# Altium schematic sheet Interface.SchDoc
size A; SheetNumber: 2
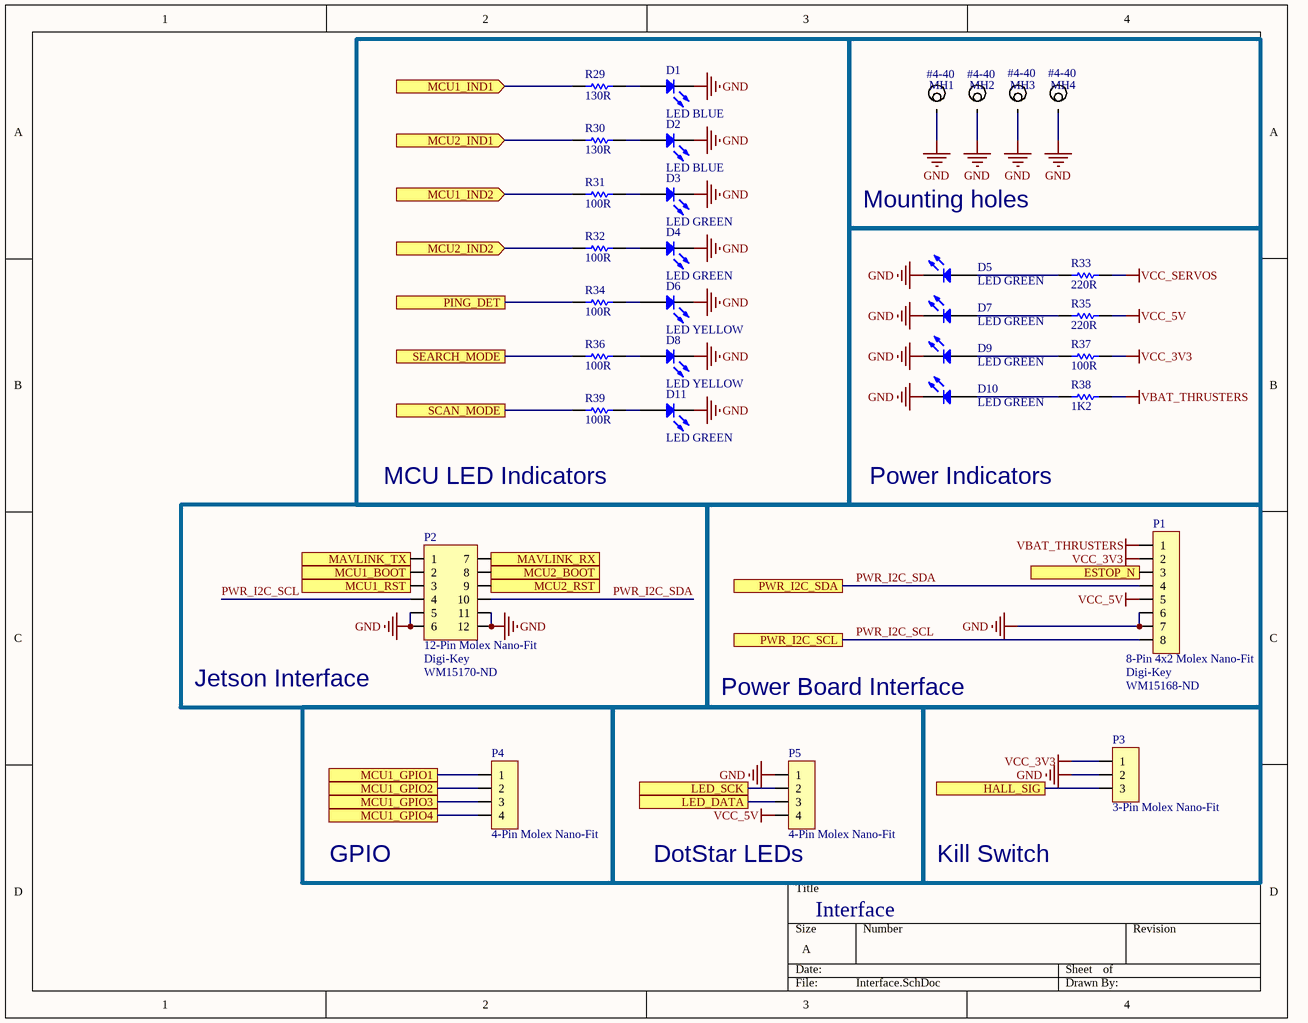
[diagram p0: Interface.SchDoc]

## Parts
D1  LED BLUE  [LED_0805]
D2  LED BLUE  [LED_0805]
D3  LED GREEN  [LED_0805]
D4  LED GREEN  [LED_0805]
D5  LED GREEN  [LED_0805]
D6  LED YELLOW  [LED_0805]
D7  LED GREEN  [LED_0805]
D8  LED YELLOW  [LED_0805]
D9  LED GREEN  [LED_0805]
D10  LED GREEN  [LED_0805]
D11  LED GREEN  [LED_0805]
MH1  #4-40  [Mounting Hole #4-40]
MH2  #4-40  [Mounting Hole #4-40]
MH3  #4-40  [Mounting Hole #4-40]
MH4  #4-40  [Mounting Hole #4-40]
P1  8-Pin 4x2 Molex Nano-Fit  Supplier 1: Digi-Key  Supplier Part Number 1: WM15168-ND  [MOLEX NANO-FIT 2x4]
P2  12-Pin Molex Nano-Fit  Supplier 1: Digi-Key  Supplier Part Number 1: WM15170-ND  [MOLEX NANO-FIT 2X6 - Right Angle]
P3  3-Pin Molex Nano-Fit  [MOLEX NANO-FIT 1X3]
P4  4-Pin Molex Nano-Fit  [MOLEX NANO-FIT 1X4]
P5  4-Pin Molex Nano-Fit  [MOLEX NANO-FIT 1X4]
R29  130R  [RESC0603(1608)_N]
R30  130R  [RESC0603(1608)_N]
R31  100R  [RESC0603(1608)_N]
R32  100R  [RESC0603(1608)_N]
R33  220R  [RESC0603(1608)_N]
R34  100R  [RESC0603(1608)_N]
R35  220R  [RESC0603(1608)_N]
R36  100R  [RESC0603(1608)_N]
R37  100R  [RESC0603(1608)_N]
R38  1K2  [RESC0603(1608)_N]
R39  100R  [RESC0603(1608)_N]

## Blocks framed on the sheet
MCU LED Indicators: D1-D4 D6 D8 D11 R29-R32 R34 R36 R39
Mounting holes: MH1-MH4
Power Indicators: D5 D7 D9 D10 R33 R35 R37 R38
GPIO: P4
Kill Switch: P3

## Ports
ESTOP_N, HALL_SIG, LED_DATA, LED_SCK, MAVLINK_RX, MAVLINK_TX, MCU1_BOOT (in), MCU1_GPIO1, MCU1_GPIO2, MCU1_GPIO3, MCU1_GPIO4, MCU1_IND1 (in), MCU1_IND2 (in), MCU1_RST (in), MCU2_BOOT (in), MCU2_IND1 (in), MCU2_IND2 (in), MCU2_RST (in), PING_DET, PWR_I2C_SCL, PWR_I2C_SDA, SCAN_MODE, SEARCH_MODE

## Nets
GND: D1.1(K) D2.1(K) D3.1(K) D4.1(K) D5.1(K) D6.1(K) D7.1(K) D8.1(K) D9.1(K) D10.1(K) D11.1(K) MH1.0 MH2.0 MH3.0 MH4.0 P1.6 P1.7 P2.5 P2.6 P2.11 P2.12 P3.2 P5.1
VBAT_THRUSTERS: P1.1 R38.2
VCC_3V3: P1.2 P3.1 R37.2
VCC_5V: P1.5 P5.4 R35.2
VCC_SERVOS: R33.2
ESTOP_N: P1.3 ; port ESTOP_N
HALL_SIG: P3.3 ; port HALL_SIG
LED_DATA: P5.3 ; port LED_DATA
LED_SCK: P5.2 ; port LED_SCK
MAVLINK_RX: P2.7 ; port MAVLINK_RX
MAVLINK_TX: P2.1 ; port MAVLINK_TX
MCU1_BOOT: P2.2 ; port MCU1_BOOT
MCU1_GPIO1: P4.1 ; port MCU1_GPIO1
MCU1_GPIO2: P4.2 ; port MCU1_GPIO2
MCU1_GPIO3: P4.3 ; port MCU1_GPIO3
MCU1_GPIO4: P4.4 ; port MCU1_GPIO4
MCU1_IND1: R29.1 ; port MCU1_IND1
MCU1_IND2: R31.1 ; port MCU1_IND2
MCU1_RST: P2.3 ; port MCU1_RST
MCU2_BOOT: P2.8 ; port MCU2_BOOT
MCU2_IND1: R30.1 ; port MCU2_IND1
MCU2_IND2: R32.1 ; port MCU2_IND2
MCU2_RST: P2.9 ; port MCU2_RST
PING_DET: R34.1 ; port PING_DET
PWR_I2C_SCL: P1.8 P2.4 ; port PWR_I2C_SCL
PWR_I2C_SDA: P1.4 P2.10 ; port PWR_I2C_SDA
SCAN_MODE: R39.1 ; port SCAN_MODE
SEARCH_MODE: R36.1 ; port SEARCH_MODE
NetD1_2: D1.2(A) R29.2
NetD2_2: D2.2(A) R30.2
NetD3_2: D3.2(A) R31.2
NetD4_2: D4.2(A) R32.2
NetD5_2: D5.2(A) R33.1
NetD6_2: D6.2(A) R34.2
NetD7_2: D7.2(A) R35.1
NetD8_2: D8.2(A) R36.2
NetD9_2: D9.2(A) R37.1
NetD10_2: D10.2(A) R38.1
NetD11_2: D11.2(A) R39.2

## Notes on the sheet
- (near P2) Jetson Interface
- Power Board Interface
- (near P5) DotStar LEDs
- Interface

## Library data of the parts
D1 D2 = LED0: led; Manufacturer 1: Kingbright; Manufacturer Part Number 1: APT2012LVBC/D; Lens Colour: Colorless; Lens Transparency: Clear; Luminous Intensity: 24mcd; Test Current: 2mA; Viewing Angle: 120°; Dominant Wavelength: 470nm; Forward Voltage: 2.65V; Supplier 1: Digi-Key; Supplier Part Number 1: 754-1938-1-ND; Stock 1: 44757; Pricing 1: 1=0.69, 10=0.541, 25=0.4508, 100=0.3885, 250=0.3469, 500=0.2983, 1000=0.2303 (USD); Mount: Surface Mount; Case/Package: 0805; Colour: Blue; Case Code (Metric): 2012; Case Code (Imperial): 0805; Packaging: Tape and Reel; Length: 2mm; Height: 0.75mm; Width: 1.25mm; Lead Free: Lead Free; ComponentLink1URL: http://www.mouser.com/ds/2/216/APT2012LVBC-D-535767.pdf; ComponentLink1Description: http://www.mouser.com/ds/2/216/APT2012LVBC-D-535767.pdf; ComponentLink2URL: http://www.kingbrightusa.com/images/catalog/SPEC/APT2012LVBC-D.pdf; ComponentLink2Description: http://www.kingbrightusa.com/images/catalog/SPEC/APT2012LVBC-D.pdf
D3-D5 D7 D9-D11 = LED0: led; Manufacturer: Lite-On Inc.; Manufacturer Part Number: LTST-C171KGKT; Lens Color: Colorless; Lens Transparency: Clear; Millicandela Rating: 35mcd; Lens Style/Size: Rectangle with Flat Top, 1.40mm x 1.25mm; Voltage - Forward (Vf) (Typ): 2V; Current - Test: 20mA; Viewing Angle: 130°; Wavelength - Dominant: 571nm; Wavelength - Peak: 574nm; Supplier 1: Digi-Key; Supplier Part Number 1: 160-1426-1-ND; RoHS: RoHS Compliant; Category: Optoelectronics; Stock 1: 350441; Pricing 1: 1=0.31, 10=0.225, 25=0.1656, 100=0.1183, 250=0.0804, 500=0.07096, 1000=0.05558 (USD); Packaging: Cut Tape (CT); Part Status: Active; Color: Green; Mounting Type: Surface Mount; Features: -; Package / Case: 0805 (2012 Metric); Size / Dimension: 2.00mm L x 1.25mm W; Height (Max): 0.90mm; ComponentLink1URL: http://optoelectronics.liteon.com/upload/download/DS22-2000-118/LTST-C171KGKT.pdf; ComponentLink1Description: http://optoelectronics.liteon.com/upload/download/DS22-2000-118/LTST-C171KGKT.pdf
D6 D8 = LED0: led / LTST-C171KSKT; Manufacturer: Lite-On Inc.; Manufacturer Part Number: LTST-C171KGKT; Color: Green; Lens Color: Colorless; Lens Transparency: Clear; Millicandela Rating: 35mcd; Lens Style/Size: Rectangle with Flat Top, 1.40mm x 1.25mm; Voltage - Forward (Vf) (Typ): 2V; Current - Test: 20mA; Viewing Angle: 130°; Wavelength - Dominant: 571nm; Wavelength - Peak: 574nm; Supplier 1: Digi-Key; Supplier Part Number 1: 160-1426-1-ND; RoHS: RoHS Compliant; Category: Optoelectronics; Stock 1: 350441; Pricing 1: 1=0.31, 10=0.225, 25=0.1656, 100=0.1183, 250=0.0804, 500=0.07096, 1000=0.05558 (USD); Packaging: Cut Tape (CT); Part Status: Active; Mounting Type: Surface Mount; Features: -; Package / Case: 0805 (2012 Metric); Size / Dimension: 2.00mm L x 1.25mm W; Height (Max): 0.90mm; ComponentLink1URL: http://optoelectronics.liteon.com/upload/download/DS22-2000-110/LTST-C171KSKT.pdf; ComponentLink1Description: http://optoelectronics.liteon.com/upload/download/DS22-2000-110/LTST-C171KSKT.pdf
MH1-MH4 = Mounting Hole #4-40, Loose Fit: Mounting Hole for ANSI #4-40 w/ Flat Washer, Loose Fit; Datasheet: http://blogs.mentor.com/tom-hausherr/blog/tag/pcb-mounting-holes/
P1 = 8-Pin 2-Row Nano-Fit: NanoFit RA Hdr TH DR 8Ckt; Part Number: 105314-1216; Supplier: Digi-Key; Manufacturer: Molex; Supplier Part Number: WM15165-ND
P2 = 12-Pin 2-Row Nano-Fit: NanoFit RA Hdr TH DR 12Ckt; ComponentLink1Description: Digikey Link; ComponentLink1URL: https://www.digikey.com/product-detail/en/molex-llc/1053141312/WM15170-ND/6164259
P3 = 3-Pin Nano-Fit: NanoFit RA Hdr TH SR 3Ckt; Part Number: 105313-1204; Supplier: Mouser; Manufacturer: Molex; Supplier Part Number: 538-105313-1204
P4 P5 = 4-Pin Nano-Fit: NanoFit RA Hdr TH SR 4Ckt; Part Number: 105313-1204; Supplier: Mouser; Manufacturer: Molex; Supplier Part Number: 538-105313-1204
R29 R30 = CMP-1012-00409-1: 130R 0.1W 1% 0603 (1608 Metric)  SMD; Case-Metric: 1608; Case-EIA: 0603; Value: 130.00 Ohm; Power: 0.1 W; Tolerance: 1 %; Technology: SMT
R31 R32 R34 R36 R37 R39 = CMP-1012-00050-1: 100R 0.1W 5% 0603 (1608 Metric)  SMD; Case-EIA: 0603; Value: 100.00 Ohm; Case-Metric: 1608; Tolerance: 5 %; Technology: SMT; Power: 0.1 W
R33 R35 = CMP-1012-00058-1: 220R 0.1W 5% 0603 (1608 Metric)  SMD; Case-EIA: 0603; Case-Metric: 1608; Value: 220.00 Ohm; Technology: SMT; Power: 0.1 W; Tolerance: 5 %
R38 = CMP-1012-00518-1: 1K2 0.1W 1% 0603 (1608 Metric)  SMD; Case-EIA: 0603; Value: 1200.00 Ohm; Case-Metric: 1608; Power: 0.1 W; Technology: SMT; Tolerance: 1 %